# EAGLE schematic h4k1 (EAGLE 7.2.0)
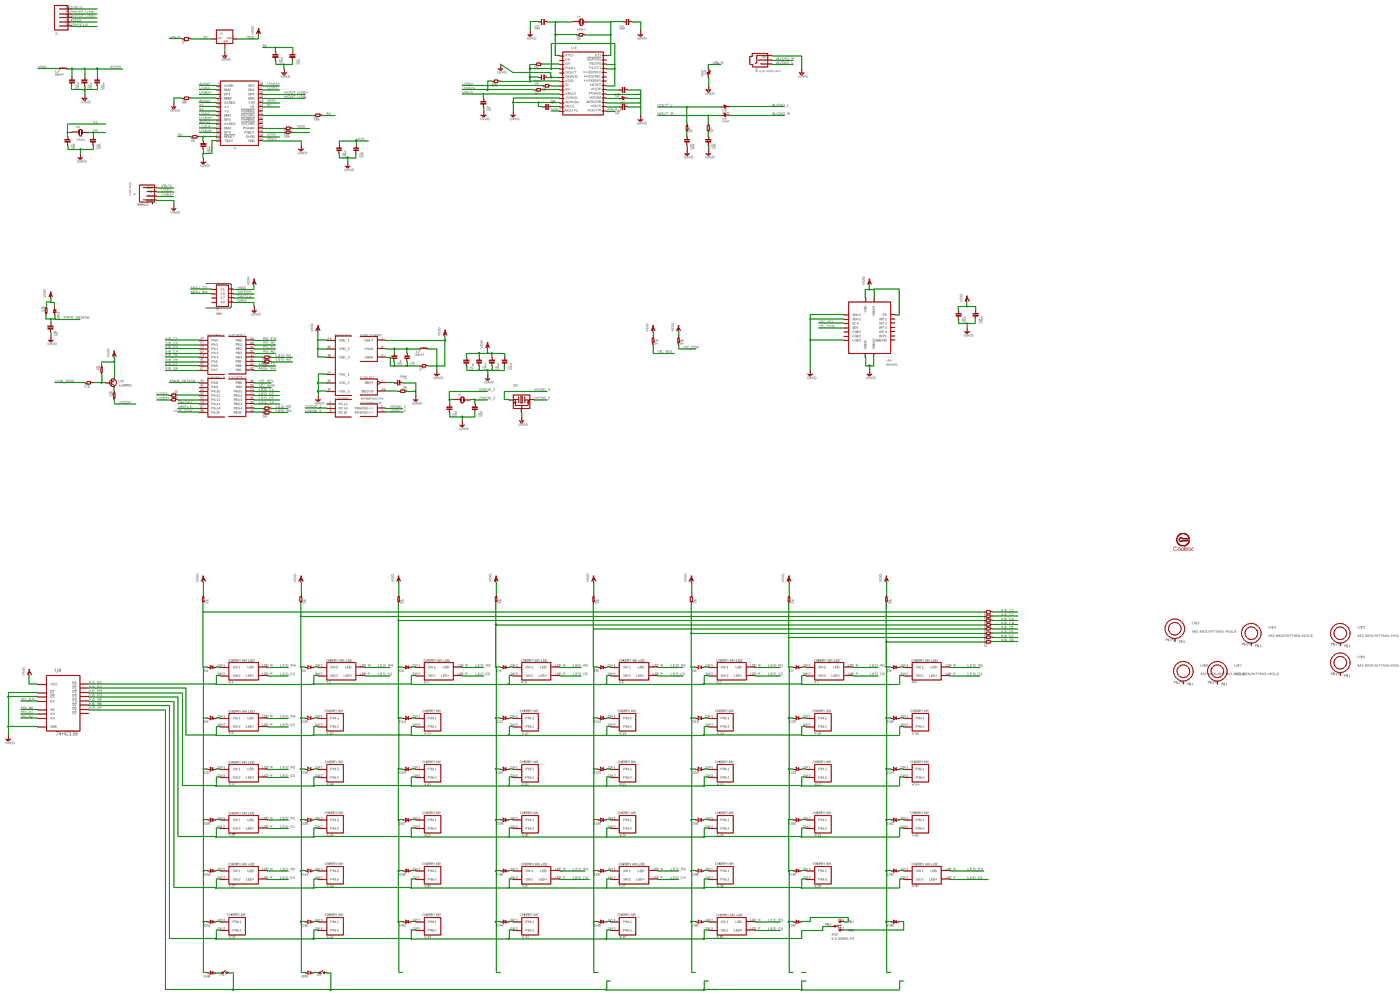
[diagram p0: schematic, sheet 1, overview]
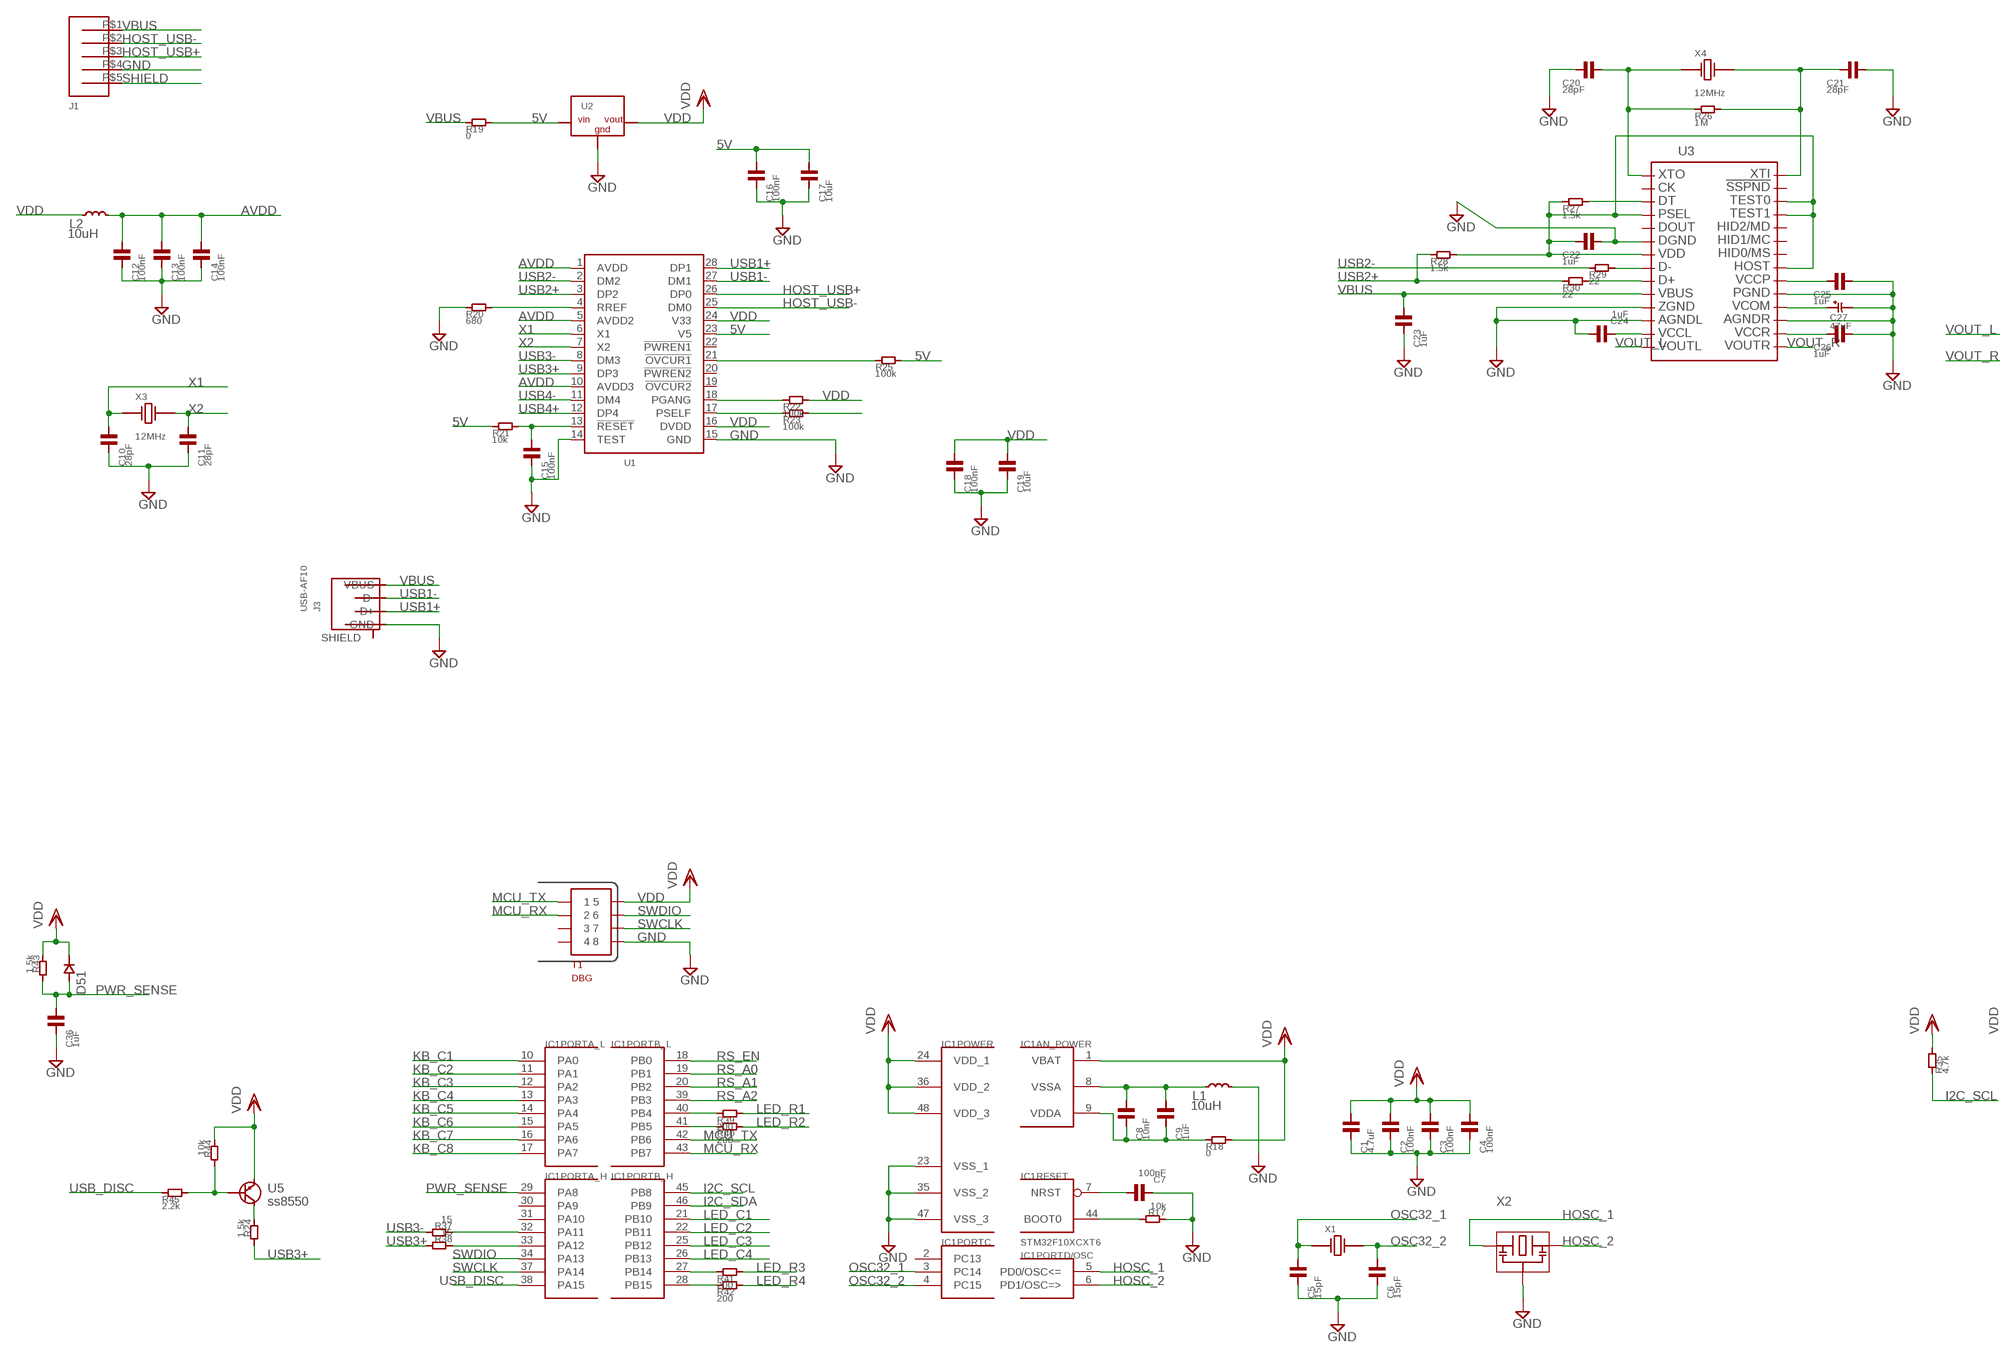
[diagram p1: schematic, sheet 1, part 1 of 4]
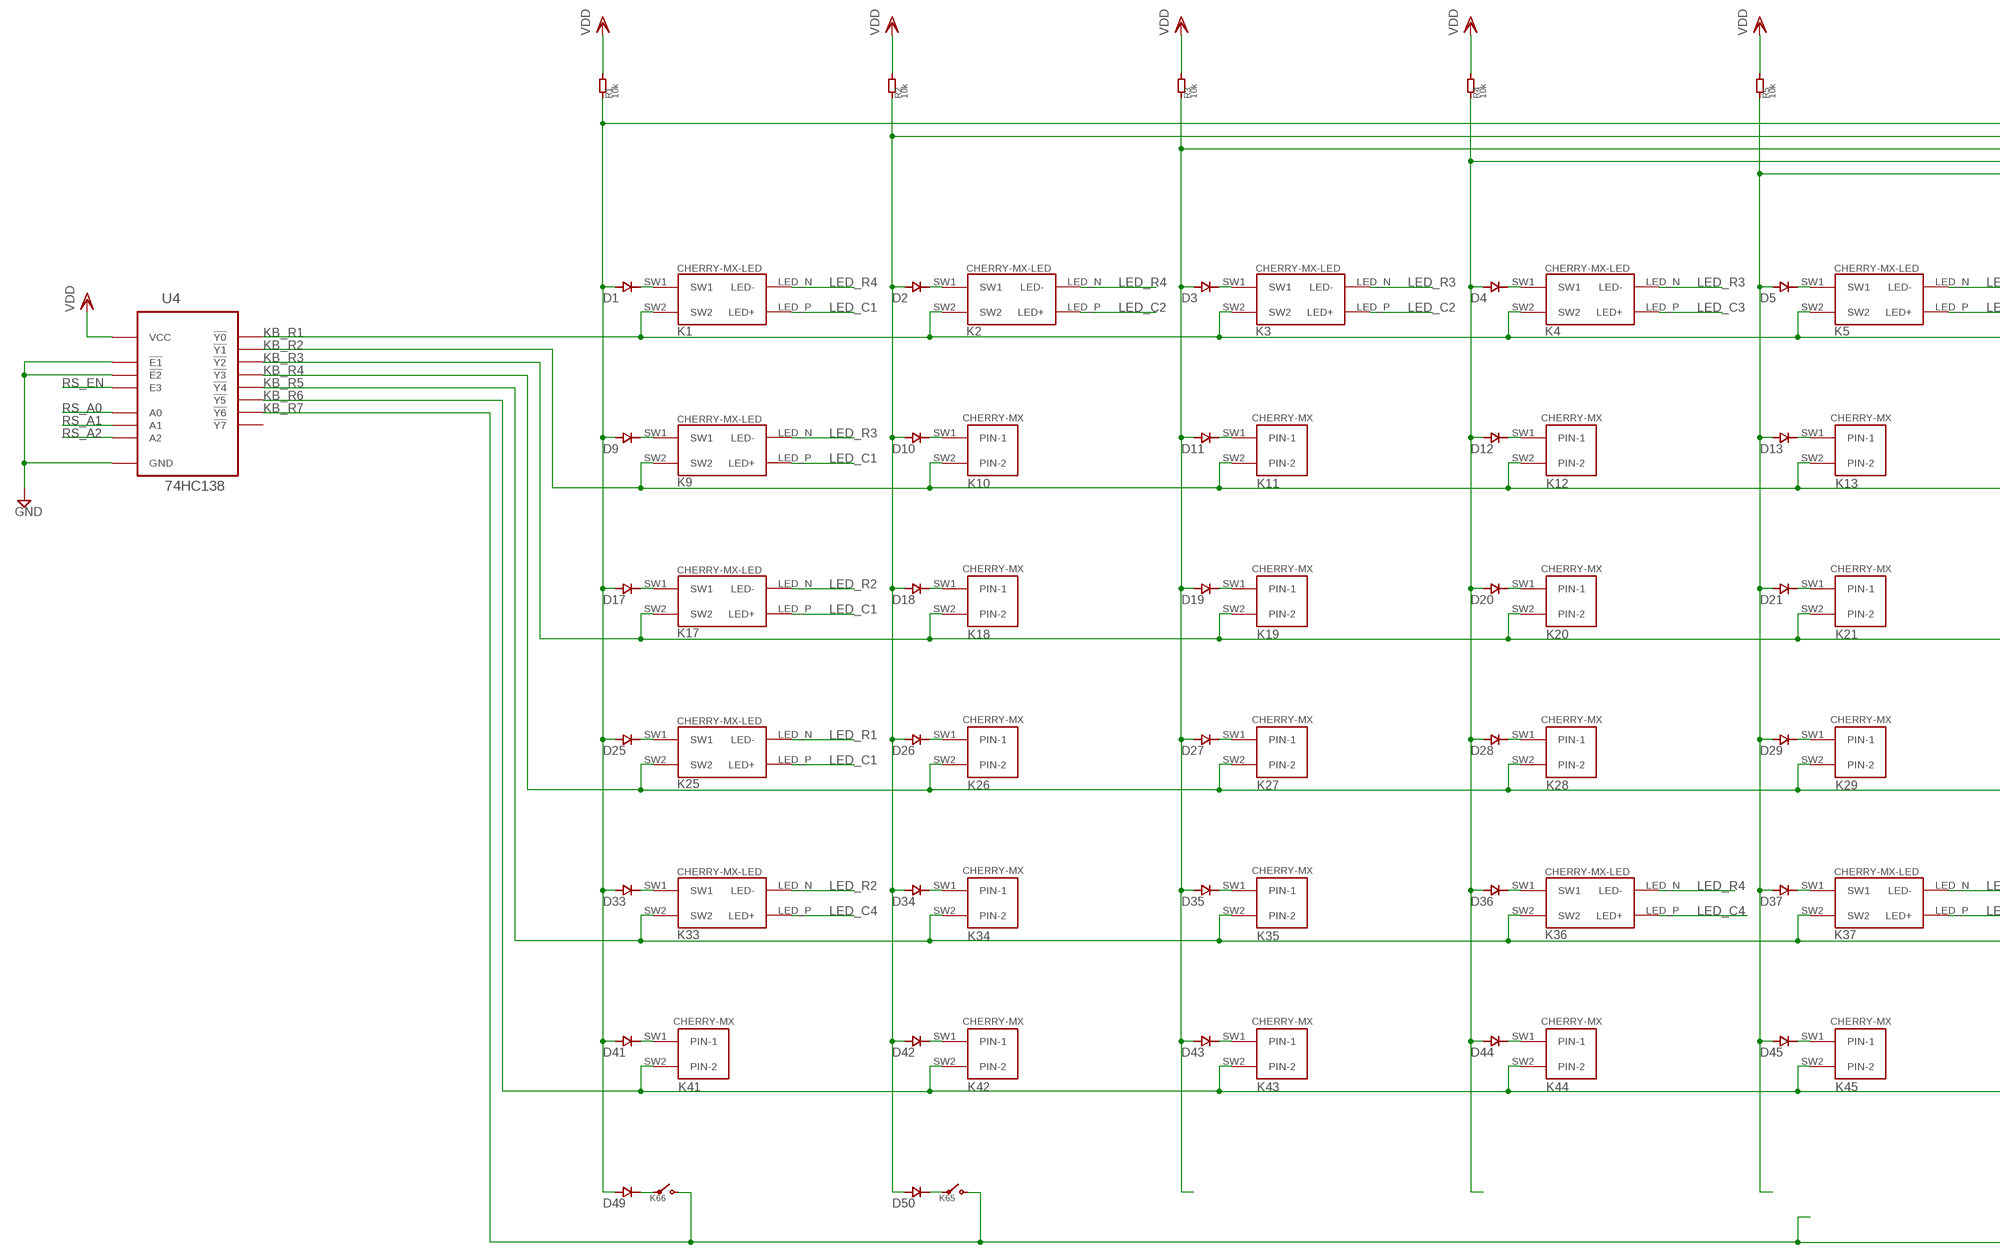
[diagram p2: schematic, sheet 1, part 2 of 4]
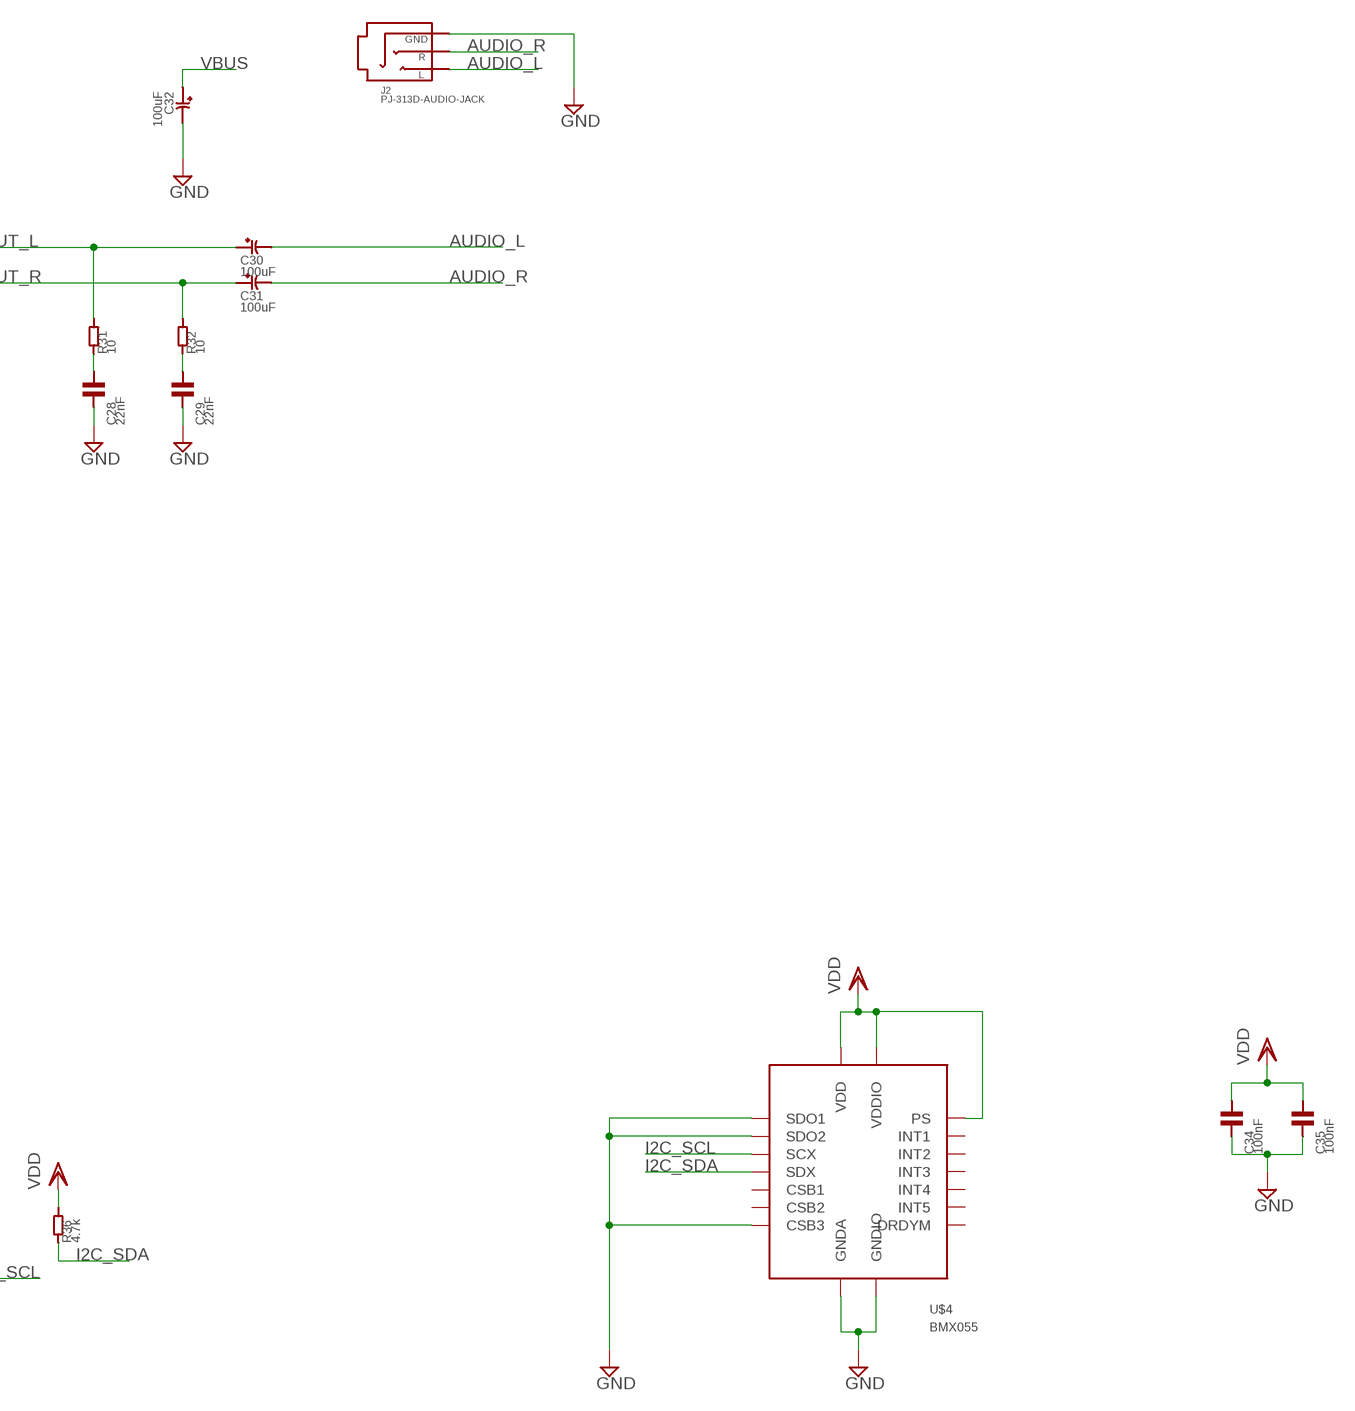
[diagram p3: schematic, sheet 1, part 3 of 4]
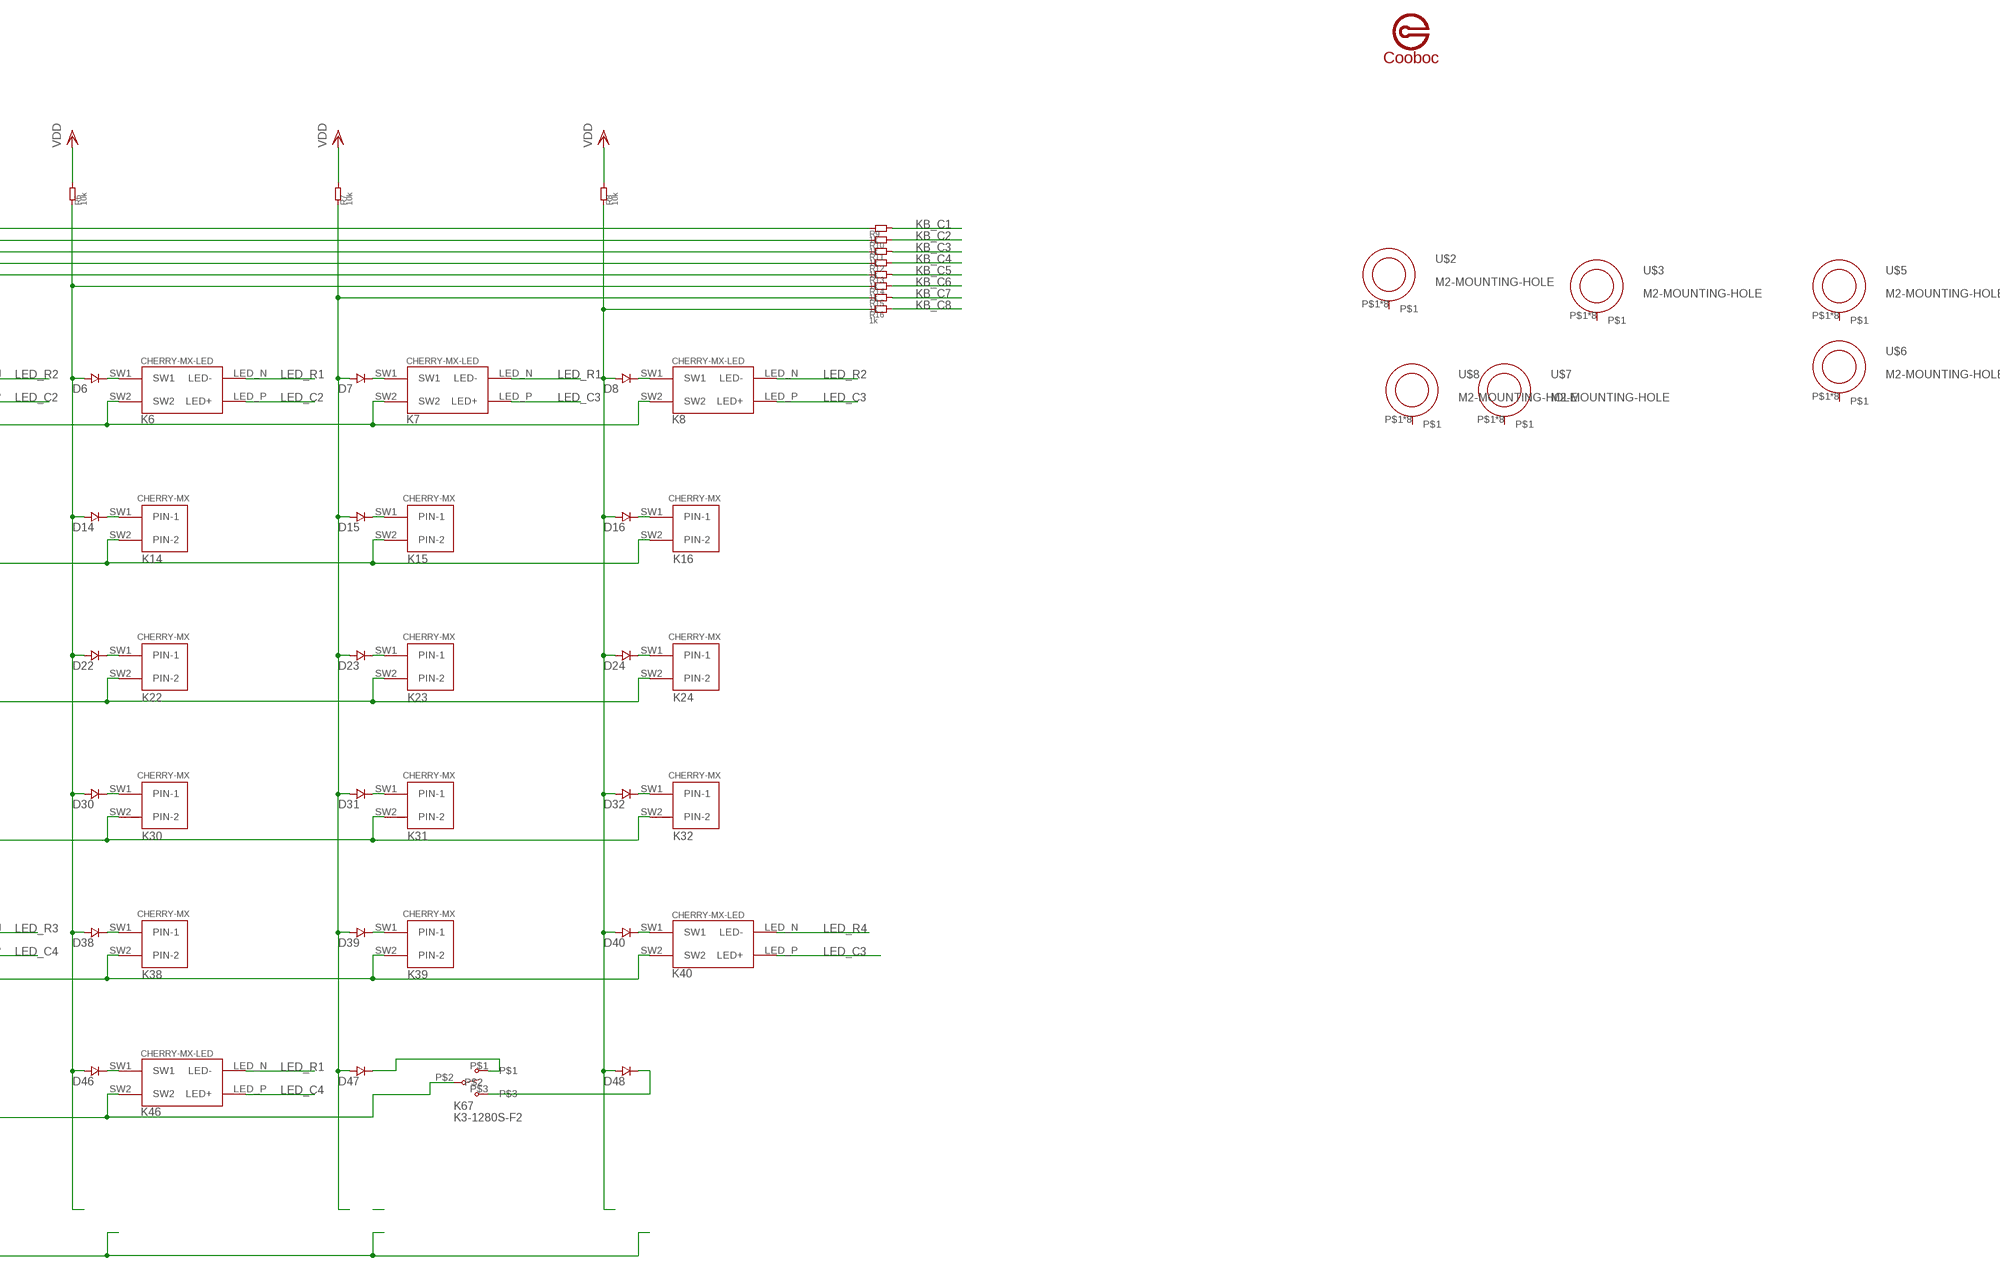
[diagram p4: schematic, sheet 1, part 4 of 4]

## Parts
C1  4.7uF  C-0805  [0805]
C2  100nF  C-0805  [0805]
C3  100nF  C-0805  [0805]
C4  100nF  C-0805  [0805]
C5  15pF  C-0805  [0805]
C6  15pF  C-0805  [0805]
C7  100nF  C-0805  [0805]
C8  10nF  C-0805  [0805]
C9  1uF  C-0805  [0805]
C10  28pF  C-0805  [0805]
C11  28pF  C-0805  [0805]
C12  100nF  C-0805  [0805]
C13  100nF  C-0805  [0805]
C14  100nF  C-0805  [0805]
C15  100nF  C-0805  [0805]
C16  100nF  C-0805  [0805]
C17  10uF  C-0805  [0805]
C18  100nF  C-0805  [0805]
C19  10uF  C-0805  [0805]
C20  28pF  C-0805  [0805]
C21  28pF  C-0805  [0805]
C22  1uF  C-0805  [0805]
C23  1uF  C-0805  [0805]
C24  1uF  C-0805  [0805]
C25  1uF  C-0805  [0805]
C26  1uF  C-0805  [0805]
C27  47uF  CPOL-6.3X5.4  [CPOL-6.3X5.4]
C28  22nF  C-0805  [0805]
C29  22nF  C-0805  [0805]
C30  100uF  CPOL-6.3X5.4  [CPOL-6.3X5.4]
C31  100uF  CPOL-6.3X5.4  [CPOL-6.3X5.4]
C32  100uF  CPOL-6.3X5.4  [CPOL-6.3X5.4]
C34  100nF  C-0805  [0805]
C35  100nF  C-0805  [0805]
C36  1uF  C-0805  [0805]
D1  IN4148WS-SWITCHING-DIODE  [SOD-323]
D2  IN4148WS-SWITCHING-DIODE  [SOD-323]
D3  IN4148WS-SWITCHING-DIODE  [SOD-323]
D4  IN4148WS-SWITCHING-DIODE  [SOD-323]
D5  IN4148WS-SWITCHING-DIODE  [SOD-323]
D6  IN4148WS-SWITCHING-DIODE  [SOD-323]
D7  IN4148WS-SWITCHING-DIODE  [SOD-323]
D8  IN4148WS-SWITCHING-DIODE  [SOD-323]
D9  IN4148WS-SWITCHING-DIODE  [SOD-323]
D10  IN4148WS-SWITCHING-DIODE  [SOD-323]
D11  IN4148WS-SWITCHING-DIODE  [SOD-323]
D12  IN4148WS-SWITCHING-DIODE  [SOD-323]
D13  IN4148WS-SWITCHING-DIODE  [SOD-323]
D14  IN4148WS-SWITCHING-DIODE  [SOD-323]
D15  IN4148WS-SWITCHING-DIODE  [SOD-323]
D16  IN4148WS-SWITCHING-DIODE  [SOD-323]
D17  IN4148WS-SWITCHING-DIODE  [SOD-323]
D18  IN4148WS-SWITCHING-DIODE  [SOD-323]
D19  IN4148WS-SWITCHING-DIODE  [SOD-323]
D20  IN4148WS-SWITCHING-DIODE  [SOD-323]
D21  IN4148WS-SWITCHING-DIODE  [SOD-323]
D22  IN4148WS-SWITCHING-DIODE  [SOD-323]
D23  IN4148WS-SWITCHING-DIODE  [SOD-323]
D24  IN4148WS-SWITCHING-DIODE  [SOD-323]
D25  IN4148WS-SWITCHING-DIODE  [SOD-323]
D26  IN4148WS-SWITCHING-DIODE  [SOD-323]
D27  IN4148WS-SWITCHING-DIODE  [SOD-323]
D28  IN4148WS-SWITCHING-DIODE  [SOD-323]
D29  IN4148WS-SWITCHING-DIODE  [SOD-323]
D30  IN4148WS-SWITCHING-DIODE  [SOD-323]
D31  IN4148WS-SWITCHING-DIODE  [SOD-323]
D32  IN4148WS-SWITCHING-DIODE  [SOD-323]
D33  IN4148WS-SWITCHING-DIODE  [SOD-323]
D34  IN4148WS-SWITCHING-DIODE  [SOD-323]
D35  IN4148WS-SWITCHING-DIODE  [SOD-323]
D36  IN4148WS-SWITCHING-DIODE  [SOD-323]
D37  IN4148WS-SWITCHING-DIODE  [SOD-323]
D38  IN4148WS-SWITCHING-DIODE  [SOD-323]
D39  IN4148WS-SWITCHING-DIODE  [SOD-323]
D40  IN4148WS-SWITCHING-DIODE  [SOD-323]
D41  IN4148WS-SWITCHING-DIODE  [SOD-323]
D42  IN4148WS-SWITCHING-DIODE  [SOD-323]
D43  IN4148WS-SWITCHING-DIODE  [SOD-323]
D44  IN4148WS-SWITCHING-DIODE  [SOD-323]
D45  IN4148WS-SWITCHING-DIODE  [SOD-323]
D46  IN4148WS-SWITCHING-DIODE  [SOD-323]
D47  IN4148WS-SWITCHING-DIODE  [SOD-323]
D48  IN4148WS-SWITCHING-DIODE  [SOD-323]
D49  IN4148WS-SWITCHING-DIODE  [SOD-323]
D50  IN4148WS-SWITCHING-DIODE  [SOD-323]
D51  IN4148WS-SWITCHING-DIODE  [SOD-323]
IC1  STM32F10XCXT6  [TQFP48]
J1  PH-5AWD  [PH-5AWD]
J2  PJ-313D-AUDIO-JACK  [PJ-313D]
J3  USB-AF10  [USB-AF10]
K1  CHERRY-MX-LED  [CHERRY-MX-LED]
K2  CHERRY-MX-LED  [CHERRY-MX-LED]
K3  CHERRY-MX-LED  [CHERRY-MX-LED]
K4  CHERRY-MX-LED  [CHERRY-MX-LED]
K5  CHERRY-MX-LED  [CHERRY-MX-LED]
K6  CHERRY-MX-LED  [CHERRY-MX-LED]
K7  CHERRY-MX-LED  [CHERRY-MX-LED]
K8  CHERRY-MX-LED  [CHERRY-MX-LED]
K9  CHERRY-MX-LED  [CHERRY-MX-LED]
K10  CHERRY-MX  [CHERRY-MX]
K11  CHERRY-MX  [CHERRY-MX]
K12  CHERRY-MX  [CHERRY-MX]
K13  CHERRY-MX  [CHERRY-MX]
K14  CHERRY-MX  [CHERRY-MX]
K15  CHERRY-MX  [CHERRY-MX]
K16  CHERRY-MX  [CHERRY-MX]
K17  CHERRY-MX-LED  [CHERRY-MX-LED]
K18  CHERRY-MX  [CHERRY-MX]
K19  CHERRY-MX  [CHERRY-MX]
K20  CHERRY-MX  [CHERRY-MX]
K21  CHERRY-MX  [CHERRY-MX]
K22  CHERRY-MX  [CHERRY-MX]
K23  CHERRY-MX  [CHERRY-MX]
K24  CHERRY-MX  [CHERRY-MX]
K25  CHERRY-MX-LED  [CHERRY-MX-LED]
K26  CHERRY-MX  [CHERRY-MX]
K27  CHERRY-MX  [CHERRY-MX]
K28  CHERRY-MX  [CHERRY-MX]
K29  CHERRY-MX  [CHERRY-MX]
K30  CHERRY-MX  [CHERRY-MX]
K31  CHERRY-MX  [CHERRY-MX]
K32  CHERRY-MX  [CHERRY-MX]
K33  CHERRY-MX-LED  [CHERRY-MX-LED]
K34  CHERRY-MX  [CHERRY-MX]
K35  CHERRY-MX  [CHERRY-MX]
K36  CHERRY-MX-LED  [CHERRY-MX-LED]
K37  CHERRY-MX-LED  [CHERRY-MX-LED]
K38  CHERRY-MX  [CHERRY-MX]
K39  CHERRY-MX  [CHERRY-MX]
K40  CHERRY-MX-LED  [CHERRY-MX-LED]
K41  CHERRY-MX  [CHERRY-MX]
K42  CHERRY-MX  [CHERRY-MX]
K43  CHERRY-MX  [CHERRY-MX]
K44  CHERRY-MX  [CHERRY-MX]
K45  CHERRY-MX  [CHERRY-MX]
K46  CHERRY-MX-LED  [CHERRY-MX-LED]
K65  EVQPUL02K  [EVQPUL]
K66  EVQPUL02K  [EVQPUL]
K67  K3-1280S-F2  [K3-1280S-F2]
L1  10uH  L-0805  [0805]
L2  10uH  L-0805  [0805]
R1  10k  R-0805  [0805]
R2  10k  R-0805  [0805]
R3  10k  R-0805  [0805]
R4  10k  R-0805  [0805]
R5  10k  R-0805  [0805]
R6  10k  R-0805  [0805]
R7  10k  R-0805  [0805]
R8  10k  R-0805  [0805]
R9  1k  R-0805  [0805]
R10  1k  R-0805  [0805]
R11  1k  R-0805  [0805]
R12  1k  R-0805  [0805]
R13  1k  R-0805  [0805]
R14  1k  R-0805  [0805]
R15  1k  R-0805  [0805]
R16  1k  R-0805  [0805]
R17  10k  R-0805  [0805]
R18  0  R-0805  [0805]
R19  0  R-0805  [0805]
R20  680  R-0805  [0805]
R21  10k  R-0805  [0805]
R22  100k  R-0805  [0805]
R23  100k  R-0805  [0805]
R24  1.5k  R-0805  [0805]
R25  100k  R-0805  [0805]
R26  1M  R-0805  [0805]
R27  1.5k  R-0805  [0805]
R28  1.5k  R-0805  [0805]
R29  22  R-0805  [0805]
R30  22  R-0805  [0805]
R31  10  R-0805  [0805]
R32  10  R-0805  [0805]
R35  4.7k  R-0805  [0805]
R36  4.7k  R-0805  [0805]
R37  15  R-0805  [0805]
R38  15  R-0805  [0805]
R39  200  R-0805  [0805]
R40  200  R-0805  [0805]
R41  200  R-0805  [0805]
R42  200  R-0805  [0805]
R43  1.5k  R-0805  [0805]
R44  10k  R-0805  [0805]
R45  2.2k  R-0805  [0805]
T1  DBG  CLIP-8P-1.27  [CLIP-8P-1.27]
U1  GL850G  [SSOP28]
U2  AMS1117-33  [SOT223]
U3  PCM2704CDB  [SSOP28]
U4  74HC138  [SSOP16-208MIL]
U5  ss8550  SS8550-SOT-323  [SOT-323]
U$1  COOBOC-PLACE  [COOBOC-PLACE]
U$2  M2-MOUNTING-HOLE  [M2-MOUNTING-HOLE]
U$3  M2-MOUNTING-HOLE  [M2-MOUNTING-HOLE]
U$4  BMX055  [BMX055]
U$5  M2-MOUNTING-HOLE  [M2-MOUNTING-HOLE]
U$6  M2-MOUNTING-HOLE  [M2-MOUNTING-HOLE]
U$7  M2-MOUNTING-HOLE  [M2-MOUNTING-HOLE]
U$8  M2-MOUNTING-HOLE  [M2-MOUNTING-HOLE]
X1  FC-12M-32.768  [CRYSTAL-2012]
X2  CSTCC8M00G53-R0-7230-8M-15P-RESONATOR  [7230-RESONATOR]
X3  12MHz  49S-CRYSTAL  [49S]
X4  12MHz  49S-CRYSTAL  [49S]

## Nets
5V: C16.P$2 C17.P$2 R19.P$2 R21.P$1 R23.P$2 R25.P$2 U1.23(V5) U2.3(VIN)
AUDIO_L: C30.P$2 J2.P3 J2.P3@2
AUDIO_R: C31.P$2 J2.P2 J2.P2@2
AVDD: C12.P$2 C13.P$2 C14.P$2 L2.P$2 U1.1(AVDD) U1.5(AVDD2) U1.10(AVDD3)
GND: C1.P$1 C2.P$1 C3.P$1 C4.P$1 C5.P$1 C6.P$1 C7.P$1 C10.P$1 C11.P$1 C12.P$1 C13.P$1 C14.P$1 C15.P$1 C16.P$1 C17.P$1 C18.P$1 C19.P$1 C20.P$1 C21.P$2 C22.P$2 C23.P$1 C24.P$2 C25.P$2 C26.P$2 C27.P$2 C28.P$1 C29.P$1 C32.P$2 C34.P$1 C35.P$1 C36.P$1 IC1.23(POWER:VSS_1) IC1.35(POWER:VSS_2) IC1.47(POWER:VSS_3) J1.P$4 J2.P1 J2.P1@2 J3.P$G(GND) L1.P$2 R17.P$1 R20.P$1 T1.P$8 U1.14(TEST) U1.15(GND) U2.1(GND) U3.6 U3.11 U3.12 U3.17 U3.19 U4.P$4(!E1) U4.P$5(!E2) U4.P$8(GND) U$4.P$4(GNDA) U$4.P$6(GNDIO) U$4.P$12(SDO2) U$4.P$17(SDO1) U$4.P$20(CSB3) X2.P$2
HOSC_1: IC1.5(PORTD/OSC:PD0/OSC<=) X2.P$1
HOSC_2: IC1.6(PORTD/OSC:PD1/OSC=>) X2.P$3
HOST_USB+: J1.P$3 U1.26(DP0)
HOST_USB-: J1.P$2 U1.25(DM0)
I2C_SCL: IC1.45(PORTB_H:PB8) R35.P$1 U$4.P$9(SCX)
I2C_SDA: IC1.46(PORTB_H:PB9) R36.P$1 U$4.P$11(SDX)
KB_C1: IC1.10(PORTA_L:PA0) R9.P$2
KB_C2: IC1.11(PORTA_L:PA1) R10.P$2
KB_C3: IC1.12(PORTA_L:PA2) R11.P$2
KB_C4: IC1.13(PORTA_L:PA3) R12.P$2
KB_C5: IC1.14(PORTA_L:PA4) R13.P$2
KB_C6: IC1.15(PORTA_L:PA5) R14.P$2
KB_C7: IC1.16(PORTA_L:PA6) R15.P$2
KB_C8: IC1.17(PORTA_L:PA7) R16.P$2
KB_R1: K1.SW2 K2.SW2 K3.SW2 K4.SW2 K5.SW2 K6.SW2 K7.SW2 K8.SW2 U4.P$15(!Y0)
KB_R2: K9.SW2 K10.SW2(PIN-2) K11.SW2(PIN-2) K12.SW2(PIN-2) K13.SW2(PIN-2) K14.SW2(PIN-2) K15.SW2(PIN-2) K16.SW2(PIN-2) U4.P$14(!Y1)
KB_R3: K17.SW2 K18.SW2(PIN-2) K19.SW2(PIN-2) K20.SW2(PIN-2) K21.SW2(PIN-2) K22.SW2(PIN-2) K23.SW2(PIN-2) K24.SW2(PIN-2) U4.P$13(!Y2)
KB_R4: K25.SW2 K26.SW2(PIN-2) K27.SW2(PIN-2) K28.SW2(PIN-2) K29.SW2(PIN-2) K30.SW2(PIN-2) K31.SW2(PIN-2) K32.SW2(PIN-2) U4.P$12(!Y3)
KB_R5: K33.SW2 K34.SW2(PIN-2) K35.SW2(PIN-2) K36.SW2 K37.SW2 K38.SW2(PIN-2) K39.SW2(PIN-2) K40.SW2 U4.P$11(!Y4)
KB_R6: K41.SW2(PIN-2) K42.SW2(PIN-2) K43.SW2(PIN-2) K44.SW2(PIN-2) K45.SW2(PIN-2) K46.SW2 K67.P$2 U4.P$10(!Y5)
KB_R7: K65.P$2 K65.P$4 K66.P$2 K66.P$4 U4.P$9(!Y6)
LED_C1: IC1.21(PORTB_H:PB10) K1.LED_P(LED+) K9.LED_P(LED+) K17.LED_P(LED+) K25.LED_P(LED+)
LED_C2: IC1.22(PORTB_H:PB11) K2.LED_P(LED+) K3.LED_P(LED+) K5.LED_P(LED+) K6.LED_P(LED+)
LED_C3: IC1.25(PORTB_H:PB12) K4.LED_P(LED+) K7.LED_P(LED+) K8.LED_P(LED+) K40.LED_P(LED+)
LED_C4: IC1.26(PORTB_H:PB13) K33.LED_P(LED+) K36.LED_P(LED+) K37.LED_P(LED+) K46.LED_P(LED+)
LED_R1: K6.LED_N(LED-) K7.LED_N(LED-) K25.LED_N(LED-) K46.LED_N(LED-) R39.P$2
LED_R2: K5.LED_N(LED-) K8.LED_N(LED-) K17.LED_N(LED-) K33.LED_N(LED-) R40.P$2
LED_R3: K3.LED_N(LED-) K4.LED_N(LED-) K9.LED_N(LED-) K37.LED_N(LED-) R41.P$2
LED_R4: K1.LED_N(LED-) K2.LED_N(LED-) K36.LED_N(LED-) K40.LED_N(LED-) R42.P$2
MCU_RX: IC1.43(PORTB_L:PB7) T1.P$2
MCU_TX: IC1.42(PORTB_L:PB6) T1.P$1
N$1: D1.P$2 K1.SW1
N$2: D1.P$1 D9.P$1 D17.P$1 D25.P$1 D33.P$1 D41.P$1 D49.P$1 R1.P$1 R9.P$1
N$3: D9.P$2 K9.SW1
N$4: D2.P$2 K2.SW1
N$5: D2.P$1 D10.P$1 D18.P$1 D26.P$1 D34.P$1 D42.P$1 D50.P$1 R2.P$1 R10.P$1
N$6: IC1.44(RESET:BOOT0) R17.P$2
N$7: D3.P$2 K3.SW1
N$8: C8.P$2 C9.P$2 IC1.8(AN_POWER:VSSA) L1.P$1
N$9: C7.P$2 IC1.7(RESET:NRST)
N$10: D4.P$2 K4.SW1
N$11: D4.P$1 D12.P$1 D20.P$1 D28.P$1 D36.P$1 D44.P$1 R4.P$1 R12.P$1
N$12: D5.P$2 K5.SW1
N$13: D5.P$1 D13.P$1 D21.P$1 D29.P$1 D37.P$1 D45.P$1 R5.P$1 R13.P$1
N$14: D6.P$2 K6.SW1
N$15: D6.P$1 D14.P$1 D22.P$1 D30.P$1 D38.P$1 D46.P$1 R6.P$1 R14.P$1
N$16: D7.P$2 K7.SW1
N$17: D7.P$1 D15.P$1 D23.P$1 D31.P$1 D39.P$1 D47.P$1 R7.P$1 R15.P$1
N$18: D10.P$2 K10.SW1(PIN-1)
N$19: D8.P$2 K8.SW1
N$20: D8.P$1 D16.P$1 D24.P$1 D32.P$1 D40.P$1 D48.P$1 R8.P$1 R16.P$1
N$21: C8.P$1 C9.P$1 IC1.9(AN_POWER:VDDA) R18.P$1
N$22: D11.P$2 K11.SW1(PIN-1)
N$23: D3.P$1 D11.P$1 D19.P$1 D27.P$1 D35.P$1 D43.P$1 R3.P$1 R11.P$1
N$24: C15.P$2 R21.P$2 U1.13(!RESET)
N$25: D12.P$2 K12.SW1(PIN-1)
N$26: R20.P$2 U1.4(RREF)
N$27: D13.P$2 K13.SW1(PIN-1)
N$28: R22.P$1 U1.18(PGANG)
N$29: D14.P$2 K14.SW1(PIN-1)
N$30: R23.P$1 U1.17(PSELF)
N$31: D15.P$2 K15.SW1(PIN-1)
N$32: C20.P$2 R26.P$1 U3.1 X4.P$1
N$33: D16.P$2 K16.SW1(PIN-1)
N$34: R25.P$1 U1.21(!OVCUR1)
N$35: D17.P$2 K17.SW1
N$36: C21.P$1 R26.P$2 U3.28 X4.P$2
N$37: D18.P$2 K18.SW1(PIN-1)
N$38: R29.P$2 U3.8
N$39: D19.P$2 K19.SW1(PIN-1)
N$40: R30.P$2 U3.9
N$41: D20.P$2 K20.SW1(PIN-1)
N$42: C22.P$1 R27.P$1 R28.P$2 U3.4 U3.7 U3.21 U3.25 U3.26
N$43: D21.P$2 K21.SW1(PIN-1)
N$44: C25.P$1 U3.20
N$45: D22.P$2 K22.SW1(PIN-1)
N$47: D23.P$2 K23.SW1(PIN-1)
N$48: C24.P$1 U3.13
N$49: D24.P$2 K24.SW1(PIN-1)
N$50: R27.P$2 U3.3
N$51: D25.P$2 K25.SW1
N$52: D26.P$2 K26.SW1(PIN-1)
N$53: D27.P$2 K27.SW1(PIN-1)
N$54: C26.P$1 U3.16
N$55: C27.P$1 U3.18
N$56: D28.P$2 K28.SW1(PIN-1)
N$57: D29.P$2 K29.SW1(PIN-1)
N$58: D30.P$2 K30.SW1(PIN-1)
N$59: D31.P$2 K31.SW1(PIN-1)
N$60: D32.P$2 K32.SW1(PIN-1)
N$61: D33.P$2 K33.SW1
N$63: D34.P$2 K34.SW1(PIN-1)
N$64: C29.P$2 R32.P$1
N$65: D35.P$2 K35.SW1(PIN-1)
N$66: C28.P$2 R31.P$1
N$67: D36.P$2 K36.SW1
N$68: D47.P$2 K67.P$1
N$69: D37.P$2 K37.SW1
N$70: D49.P$2 K66.P$1 K66.P$3
N$71: D38.P$2 K38.SW1(PIN-1)
N$72: IC1.32(PORTA_H:PA11) R37.P$1
N$73: D39.P$2 K39.SW1(PIN-1)
N$74: IC1.33(PORTA_H:PA12) R38.P$1
N$75: D40.P$2 K40.SW1
N$76: IC1.40(PORTB_L:PB4) R39.P$1
N$77: D41.P$2 K41.SW1(PIN-1)
N$78: D42.P$2 K42.SW1(PIN-1)
N$79: D43.P$2 K43.SW1(PIN-1)
N$80: IC1.41(PORTB_L:PB5) R40.P$1
N$81: IC1.28(PORTB_H:PB15) R42.P$1
N$82: D44.P$2 K44.SW1(PIN-1)
N$83: D45.P$2 K45.SW1(PIN-1)
N$84: D46.P$2 K46.SW1
N$85: IC1.27(PORTB_H:PB14) R41.P$1
N$86: D48.P$2 K67.P$3
N$87: R44.P$2 R45.P$2 U5.P$1(P$B)
N$88: D50.P$2 K65.P$1 K65.P$3
N$91: R24.P$1 U5.P$3(P$C)
OSC32_1: C5.P$2 IC1.3(PORTC:PC14) X1.P$1
OSC32_2: C6.P$2 IC1.4(PORTC:PC15) X1.P$2
PWR_SENSE: C36.P$2 D51.P$1 IC1.29(PORTA_H:PA8) R43.P$2
RS_A0: IC1.19(PORTB_L:PB1) U4.P$1(A0)
RS_A1: IC1.20(PORTB_L:PB2) U4.P$2(A1)
RS_A2: IC1.39(PORTB_L:PB3) U4.P$3(A2)
RS_EN: IC1.18(PORTB_L:PB0) U4.P$6(E3)
SHIELD: J1.P$5
SWCLK: IC1.37(PORTA_H:PA14) T1.P$7
SWDIO: IC1.34(PORTA_H:PA13) T1.P$6
USB1+: J3.P$D+(D+) U1.28(DP1)
USB1-: J3.P$D-(D-) U1.27(DM1)
USB2+: R28.P$1 R30.P$1 U1.3(DP2)
USB2-: R29.P$1 U1.2(DM2)
USB3+: R24.P$2 R38.P$2 U1.9(DP3)
USB3-: R37.P$2 U1.8(DM3)
USB4+: U1.12(DP4)
USB4-: U1.11(DM4)
USB_DISC: IC1.38(PORTA_H:PA15) R45.P$1
VBUS: C23.P$2 C32.P$1 J1.P$1 J3.P$V(VBUS) R19.P$1 U3.10
VDD: C1.P$2 C2.P$2 C3.P$2 C4.P$2 C18.P$2 C19.P$2 C34.P$2 C35.P$2 D51.P$2 IC1.1(AN_POWER:VBAT) IC1.24(POWER:VDD_1) IC1.36(POWER:VDD_2) IC1.48(POWER:VDD_3) L2.P$1 R1.P$2 R2.P$2 R3.P$2 R4.P$2 R5.P$2 R6.P$2 R7.P$2 R8.P$2 R18.P$2 R22.P$2 R35.P$2 R36.P$2 R43.P$1 R44.P$1 T1.P$5 U1.16(DVDD) U1.24(V33) U2.2(VOUT) U4.P$16(VCC) U5.P$2(P$E) U$4.P$3(VDD) U$4.P$7(PS) U$4.P$13(VDDIO)
VOUT_L: C30.P$1 R31.P$2 U3.14
VOUT_R: C31.P$1 R32.P$2 U3.15
X1: C10.P$2 U1.6(X1) X3.P$1
X2: C11.P$2 U1.7(X2) X3.P$2
Unconnected: IC1.2(PORTC:PC13) IC1.30(PORTA_H:PA9) IC1.31(PORTA_H:PA10) J3.PS@1(SHIELD) J3.PS@2(SHIELD) J3.PS@3(SHIELD) J3.PS@4(SHIELD) T1.P$3 T1.P$4 U1.19(!OVCUR2) U1.20(!PWREN2) U1.22(!PWREN1) U3.2 U3.5 U3.22 U3.23 U3.24 U3.27 U4.P$7(!Y7) U$2.P$1 U$2.P$2 U$2.P$3 U$2.P$4 U$2.P$5 U$2.P$6 U$2.P$7 U$2.P$8 U$3.P$1 U$3.P$2 U$3.P$3 U$3.P$4 U$3.P$5 U$3.P$6 U$3.P$7 U$3.P$8 U$4.P$1(INT2) U$4.P$2(DRDYM) U$4.P$5(CSB2) U$4.P$10(INT5) U$4.P$14(INT3) U$4.P$15(INT4) U$4.P$16(CSB1) U$4.P$19(INT1) U$5.P$1 U$5.P$2 U$5.P$3 U$5.P$4 U$5.P$5 U$5.P$6 U$5.P$7 U$5.P$8 U$6.P$1 U$6.P$2 U$6.P$3 U$6.P$4 U$6.P$5 U$6.P$6 U$6.P$7 U$6.P$8 U$7.P$1 U$7.P$2 U$7.P$3 U$7.P$4 U$7.P$5 U$7.P$6 U$7.P$7 U$7.P$8 U$8.P$1 U$8.P$2 U$8.P$3 U$8.P$4 U$8.P$5 U$8.P$6 U$8.P$7 U$8.P$8

## Library data of the parts
C1-C26 C28 C29 C34-C36 = hqc:C-0805
C27 C30-C32 = hqc:CPOL-6.3X5.4
D1-D51 = hqc-basic:IN4148WS-SWITCHING-DIODE
IC1 = stm32:STM32F10XCXT6: ST STM32F101/103 48pin LQFP
J1 = hqc-connector:PH-5AWD
J2 = hqc:PJ-313D-AUDIO-JACK
J3 = hqc:USB-AF10
K1-K9 K17 K25 K33 K36 K37 K40 K46 = hqc:CHERRY-MX-LED: Cherry MX series keyswitch with LED
K10-K16 K18-K24 K26-K32 K34 K35 K38 K39 K41-K45 = hqc:CHERRY-MX: Cherry MX series keyswitch
K65 K66 = hqc:EVQPUL02K
K67 = hqc:K3-1280S-F2
L1 L2 = hqc:L-0805
R1-R32 R35-R45 = hqc:R-0805
T1 = hqc-connector:CLIP-8P-1.27
U1 = hqc-communication:GL850G
U2 = hqc-power:AMS1117-33
U3 = hqc:PCM2704CDB
U4 = hqc:74HC138
U5 = hqc:SS8550-SOT-323
U$1 = hqc-logo:COOBOC-PLACE
U$2 U$3 U$5-U$8 = hqc:M2-MOUNTING-HOLE
U$4 = hqc:BMX055
X1 = hqc-crystal:FC-12M-32.768
X2 = hqc-crystal:CSTCC8M00G53-R0-7230-8M-15P-RESONATOR
X3 X4 = hqc-crystal:49S-CRYSTAL

## Net classes
0 default: clearance 0.205 mm